# Altium project SmartLED1.PrjPCB
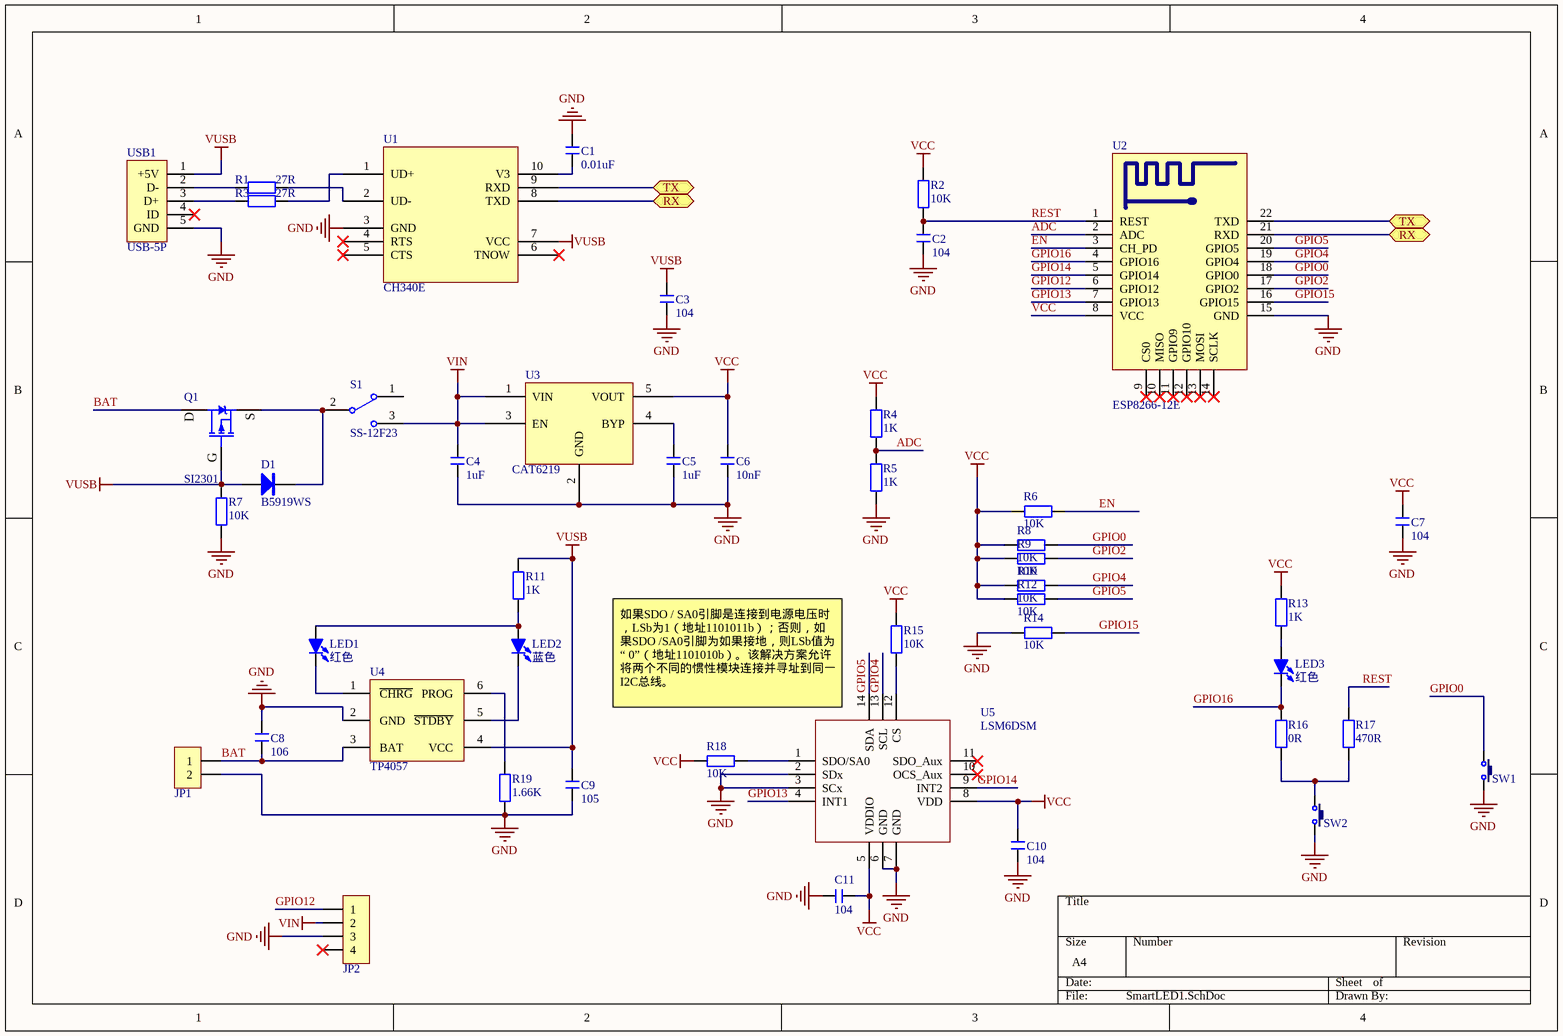
[diagram p0: SmartLED1.SchDoc]
1 sheet, 46 parts. Net scope: flat (ports and power ports of the same name join across sheets).
Board file: SmartLED1.PcbDoc

## Sheet SmartLED1.SchDoc
size A4

### Parts
C1  0.01uF  [C 0603_L]
C2  104  [C 0603_L]
C3  104  [C 0603_L]
C4  1uF  [C 0603_L]
C5  1uF  [C 0603_L]
C6  10nF  [C 0603_L]
C7  104  [C 0603_L]
C8  106  [C 0603_L]
C9  105  [C 0603_L]
C10  104  [C 0603_L]
C11  104  [C 0603_L]
D1  B5919WS  [SOD-323]
JP1  HDR-1X2  [PH2.0-WS-2P]  (value not drawn)
JP2  HDR-1X4  [HDR2.54-M-LI-4P]  (value not drawn)
LED1  红色  [LED 0603G]
LED2  蓝色  [LED 0603B]
LED3  红色  [LED 0603Y]
Q1  SI2301  [SOT23-3N]
R1  27R  [R 0603_L]
R2  10K  [R 0603_L]
R3  27R  [R 0603_L]
R4  1K  [光敏电阻]
R5  1K  [R 0603_L]
R6  10K  [R 0603_L]
R7  10K  [R 0603_L]
R8  10K  [R 0603_L]
R9  10K  [R 0603_L]
R10  10K  [R 0603_L]
R11  1K  [R 0603_L]
R12  10K  [R 0603_L]
R13  1K  [R 0603_L]
R14  10K  [R 0603_L]
R15  10K  [R 0603_L]
R16  0R  [R 0603_L]
R17  470R  [R 0603_L]
R18  10K  [R 0603_L]
R19  1.66K  [R 0603_L]
S1  SS-12F23  [SK12D07]
SW1  3x6x5  [TSW 3*6*4.3-S-W]  (value not drawn)
SW2  3x6x5  [TSW 3*6*4.3-S-W]  (value not drawn)
U1  CH340E  [MSOP10_L]
U2  ESP8266-12E  [ESP_12E]
U3  CAT6219  [SOT23-5N]
U4  TP4057  [SOT23-6N]
U5  LSM6DSM  [LSM6DSM]
USB1  USB-5P  [USB-MICRO_B]

### Ports
RX (bidir), TX (bidir)

### Nets
GND: C1.1 C2.1 C3.1 C4.1 C5.1 C6.1 C7.1 C8.2 C9.2 C10.1 C11.2 JP1.2 JP2.3 R5.1 R7.2 R14.2 R19.1 SW1.2 SW2.2 U1.3(GND) U2.15(GND) U3.2(GND) U4.2(GND) U5.2(SDx) U5.3(SCx) U5.6(GND) U5.7(GND) USB1.5(GND)
VCC: C6.2 C7.2 C10.2 C11.1 R2.2 R4.2 R6.2 R8.2 R9.2 R10.2 R12.2 R13.2 R15.1 R18.1 U2.8(VCC) U3.5(VOUT) U5.5(VDDIO) U5.8(VDD)
VIN: C4.2 JP2.2 S1.3 U3.1(VIN) U3.3(EN)
VUSB: C3.2 C9.1 D1.1(A) Q1.1(G) R7.1 R11.1 U1.7(VCC) U4.4(VCC) USB1.1(+5V)
ADC: R4.1 R5.2 U2.2(ADC)
BAT: C8.1 JP1.1 Q1.3(D) U4.3(BAT)
EN: R6.1 U2.3(CH_PD)
GPIO0: R8.1 SW1.1 U2.18(GPIO0)
GPIO2: R9.1 U2.17(GPIO2)
GPIO4: R10.1 U2.19(GPIO4) U5.13(SCL)
GPIO5: R12.1 U2.20(GPIO5) U5.14(SDA)
GPIO12: JP2.1 U2.6(GPIO12)
GPIO13: U2.7(GPIO13) U5.4(INT1)
GPIO14: U2.5(GPIO14) U5.9(INT2)
GPIO15: R14.1 U2.16(GPIO15)
GPIO16: LED3.2(K) R16.2 U2.4(GPIO16)
REST: C2.2 R2.1 R17.2 U2.1(REST)
NetC1_2: C1.2 U1.10(V3)
NetC5_2: C5.2 U3.4(BYP)
NetD1_2: D1.2(K) Q1.2(S) S1.2
NetLED1_1: LED1.1(A) LED2.1(A) R11.2
NetLED1_2: LED1.2(K) U4.1(~{CHRG})
NetLED2_2: LED2.2(K) U4.5(~{STDBY})
NetLED3_1: LED3.1(A) R13.1
NetR1_1: R1.1 USB1.2(D-)
NetR1_2: R1.2 U1.2(UD-)
NetR3_1: R3.1 USB1.3(D+)
NetR3_2: R3.2 U1.1(UD+)
NetR15_2: R15.2 U5.12(CS)
NetR16_1: R16.1 R17.1 SW2.1
NetR18_2: R18.2 U5.1(SDO/SA0)
NetR19_2: R19.2 U4.6(PROG)
NetU1_8: U1.8(TXD) U2.21(RXD) ; port RX
NetU1_9: U1.9(RXD) U2.22(TXD) ; port TX

Not connected (* = marked no-connect by the designer): JP2 4*; S1 1; U1 4(RTS)* 5(CTS)* 6(TNOW)*; U2 9(CS0)* 10(MISO)* 11(GPIO9)* 12(GPIO10)* 13(MOSI)* 14(SCLK)*; U5 10(OCS_Aux)* 11(SDO_Aux)*; USB1 4(ID)*

### Notes on the sheet
- (near U5) 如果SDO / SA0引脚是连接到电源电压时，LSb为1（地址1101011b）；否则，如果SDO /SA0引脚为如果接地，则LSb值为“ 0”（地址1101010b）。该解决方案允许将两个不同的惯性模块连接并寻址到同一I2C总线。

### Library data of the parts
C1-C11 = C: 无极性贴片电容; 版权归属: 源创客; BOM名称: 无极性贴片电容; 学习资源: www.ooocke.com
D1 = 1N5819: 肖特基二极管; 版权归属: 源创客; 属性: 40V/2A; BOM名称: 肖特基二极管; 学习资源: www.ooocke.com
JP1 = Header 2: 2P接插件; 版权归属: 源创客; BOM名称: 2P接插件; 学习资源: www.ooocke.com
JP2 = Header 4: 4P接插件; 版权归属: 源创客; BOM名称: 4P接插件; 学习资源: www.ooocke.com
LED1-LED3 = LED-SMD: 贴片LED; 版权归属: 源创客; BOM名称: 贴片LED; 学习资源: www.ooocke.com
Q1 = SI2301: P沟道场效应管; 版权归属: 源创客; BOM名称: P沟道场效应管; 学习资源: www.ooocke.com
R1-R19 = R: 贴片电阻; 版权归属: 源创客; BOM名称: 贴片电阻; 学习资源: www.ooocke.com
S1 = SSW-1P: 1路波动开关; BOM名称: 波动开关; 版权归属: 源创客; 学习资源: www.ooocke.com
SW1 SW2 = TSW 3x6: 3x6轻触开关; 版权归属: 源创客; BOM名称: 3x6轻触开关; 学习资源: www.ooocke.com
U2 = ESP8266-12E: 串口 WIFI模块，ESP-12E; BOM名称: WIFI模块; 版权归属: 源创客; 学习资源: www.ooocke.com
U5 = LSM6DSM: LSM6DSM 六轴传感器，牛皮
USB1 = USB-5P: 微型USB母座; 版权归属: 源创客; BOM名称: 微型USB母座; 学习资源: www.ooocke.com